# Altium schematic sheet STRWL-S06-V00-Peripherals.SchDoc: Peripherals
size A3; DrawnBy: John Hatfield; SheetNumber: 6; SheetTotal: 6
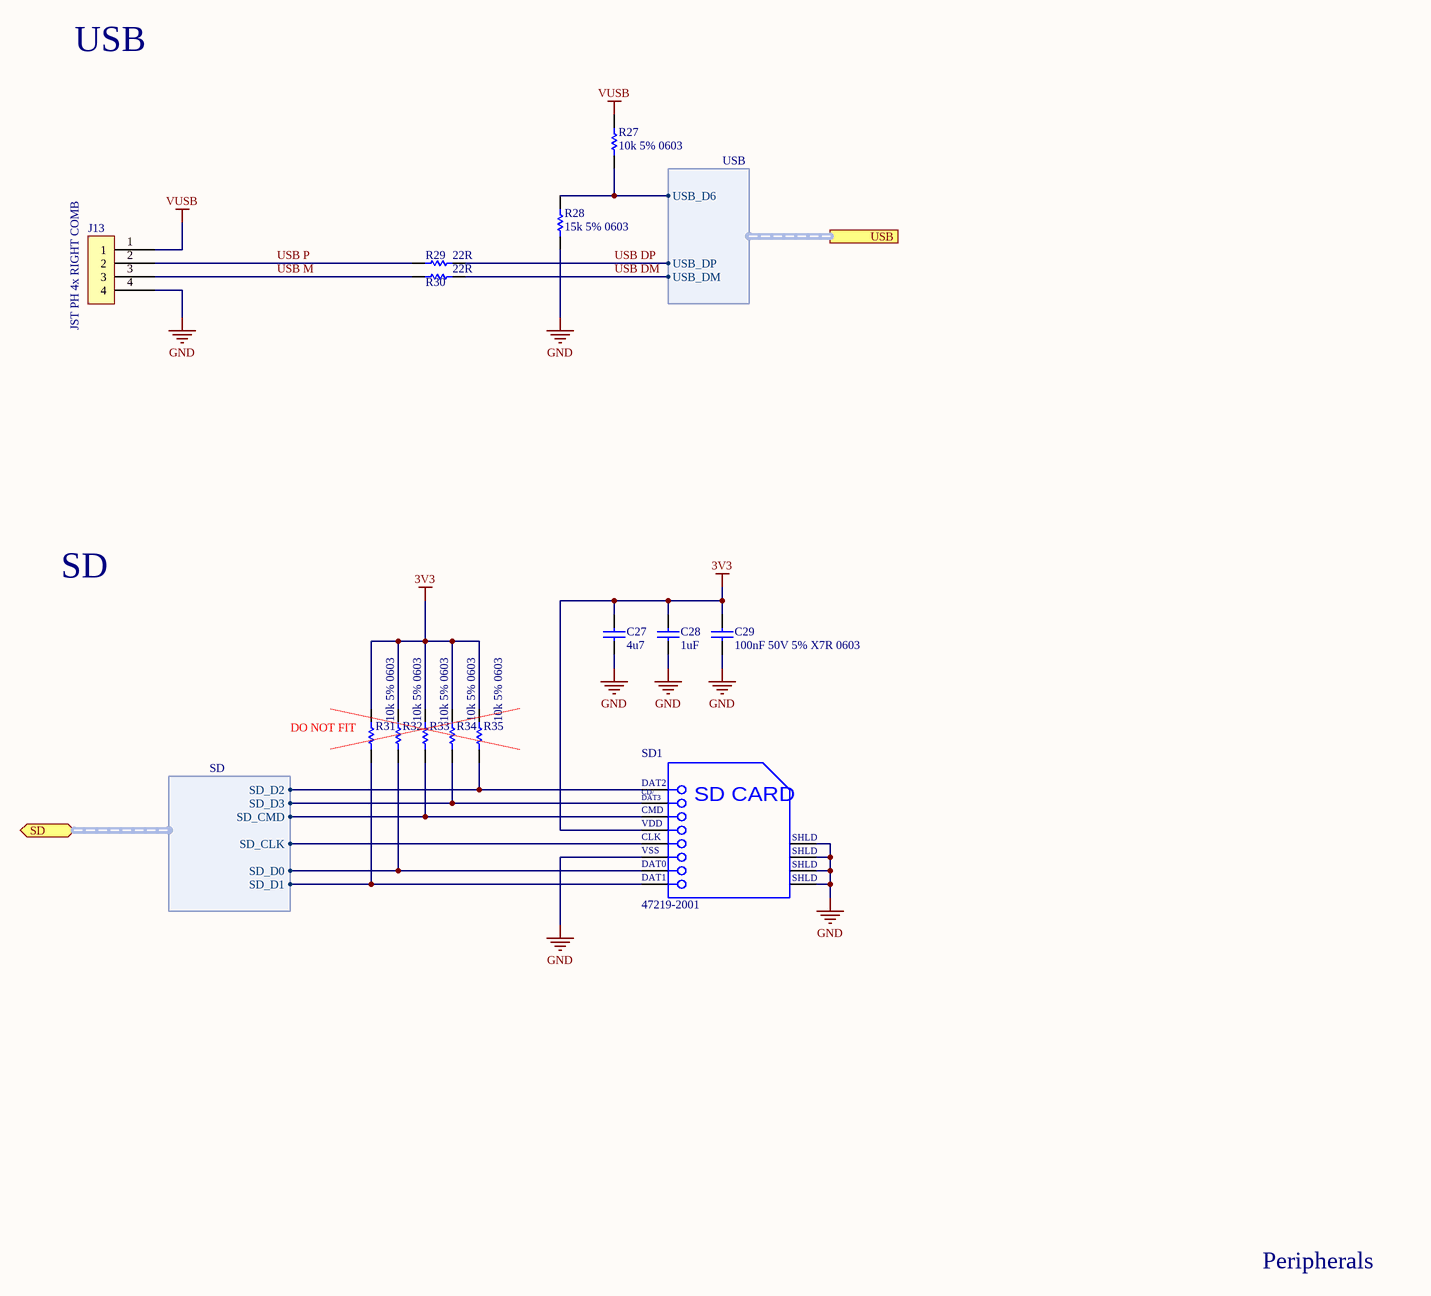
[diagram p0: STRWL-S06-V00-Peripherals.SchDoc]

## Parts
C27  4u7  [Cap_Ceramic_0603]
C28  1uF  [Cap_Ceramic_0603]
C29  100nF 50V 5% X7R 0603  [Cap_Ceramic_0603]
J13  JST PH 4x RIGHT COMB  [JST PH 4x RIGHT COMB]
R27  10k 5% 0603  [Res_ThinFilm_0603]
R28  15k 5% 0603  [Res_ThinFilm_0603]
R29  22R  [Res_ThinFilm_0603]
R30  22R  [Res_ThinFilm_0603]
R31  10k 5% 0603  [Res_ThinFilm_0603]
R32  10k 5% 0603  [Res_ThinFilm_0603]
R33  10k 5% 0603  [Res_ThinFilm_0603]
R34  10k 5% 0603  [Res_ThinFilm_0603]
R35  10k 5% 0603  [Res_ThinFilm_0603]
SD1  47219-2001  [MOLX-47219-2001-8_V]

## Ports
SD (bidir, harness SD), USB (harness USB)

## Harnesses
USB: USB_DP, USB_D6, USB_DM
SD: SD_D2, SD_D3, SD_CMD, SD_CLK, SD_D0, SD_D1

## Nets
3V3: C27.2 C28.2 C29.2 R31.2 R32.2 R33.2 R34.2 R35.2 SD1.4(VDD)
GND: C27.1 C28.1 C29.1 J13.4 R28.1 SD1.6(VSS) SD1.9(SHLD) SD1.10(SHLD) SD1.11(SHLD) SD1.12(SHLD)
VUSB: J13.1 R27.2
USB DM: R30.2 ; port USB.USB_DM
USB DP: R29.2 ; port USB.USB_DP
USB M: J13.3 R30.1
USB P: J13.2 R29.1
NetR27_1: R27.1 R28.2 ; port USB.USB_D6
NetR31_1: R31.1 SD1.8(DAT1) ; port SD.SD_D1
NetR32_1: R32.1 SD1.7(DAT0) ; port SD.SD_D0
NetR33_1: R33.1 SD1.3(CMD) ; port SD.SD_CMD
NetR34_1: R34.1 SD1.2(CD/DAT3) ; port SD.SD_D3
NetR35_1: R35.1 SD1.1(DAT2) ; port SD.SD_D2
NetSD1_5: SD1.5(CLK) ; port SD.SD_CLK

## Notes on the sheet
- USB
- SD
- (near R31) DO NOT FIT
- Peripherals
- (in symbol CMP-2000-05245-1) CD/; DAT3; SD CARD

## Library data of the parts
C27 = 4u7 50V 5% X7R 0603: Capacitor, Ceramic, SMD, 4u7, 50V, 5%, X7R, 0603
C28 = 1uF 25V 5% X7R 0603: Capacitor, Ceramic, SMD, 1uF, 25V, 5%, X7R, 0603
C29 = 100nF 50V 5% X7R 0603: Capacitor, Ceramic, SMD, 100nF, 50V, 5%, X7R, 0603
R27 R31-R35 = 10k 5% 0603: Resistor, SMD, 10k, 0.1W, 5%, 0603
R28 = 15k 5% 0603: Resistor, SMD, 15k, 0.1W, 5%, 0603
R29 R30 = 22R 1% 0603: Resistor, SMD, 22R, 0.1W, 1%, 0603
SD1 = CMP-2000-05245-1: MicroSD Card Connector, Hinge Type, -40 to 85 degC, 8-Pin SMD, RoHS, Tape and Reel; Manufacturer: Molex; Current Rating: 500mA; Number of Contacts: 8; Pitch: 1.09mm; Insertion - Extraction Style: Hinged; Voltage Rating: 100VDC; Product: CardConnectors; Contact Material: CopperAlloy; Series: 47219; Packaging: Reel; Brand: Molex; Product Category: MemoryCardConnectors; Housing Material: Thermoplastic; Mounting Style: SMD/SMT; Termination Style: SMD; Datasheet Version: Rev. F, 06/2009; Card Type: microSD; Manufacturer URL: http://www.molex.com/; RoHS: Details; Datasheet URL: http://www.molex.com/pdm_docs/sd/472192001_sd.pdf; Factory Pack Quantity: 2400